# EAGLE design Linkable_LED_Matrix_Thru_Full_Mount (EAGLE 6.5.0)
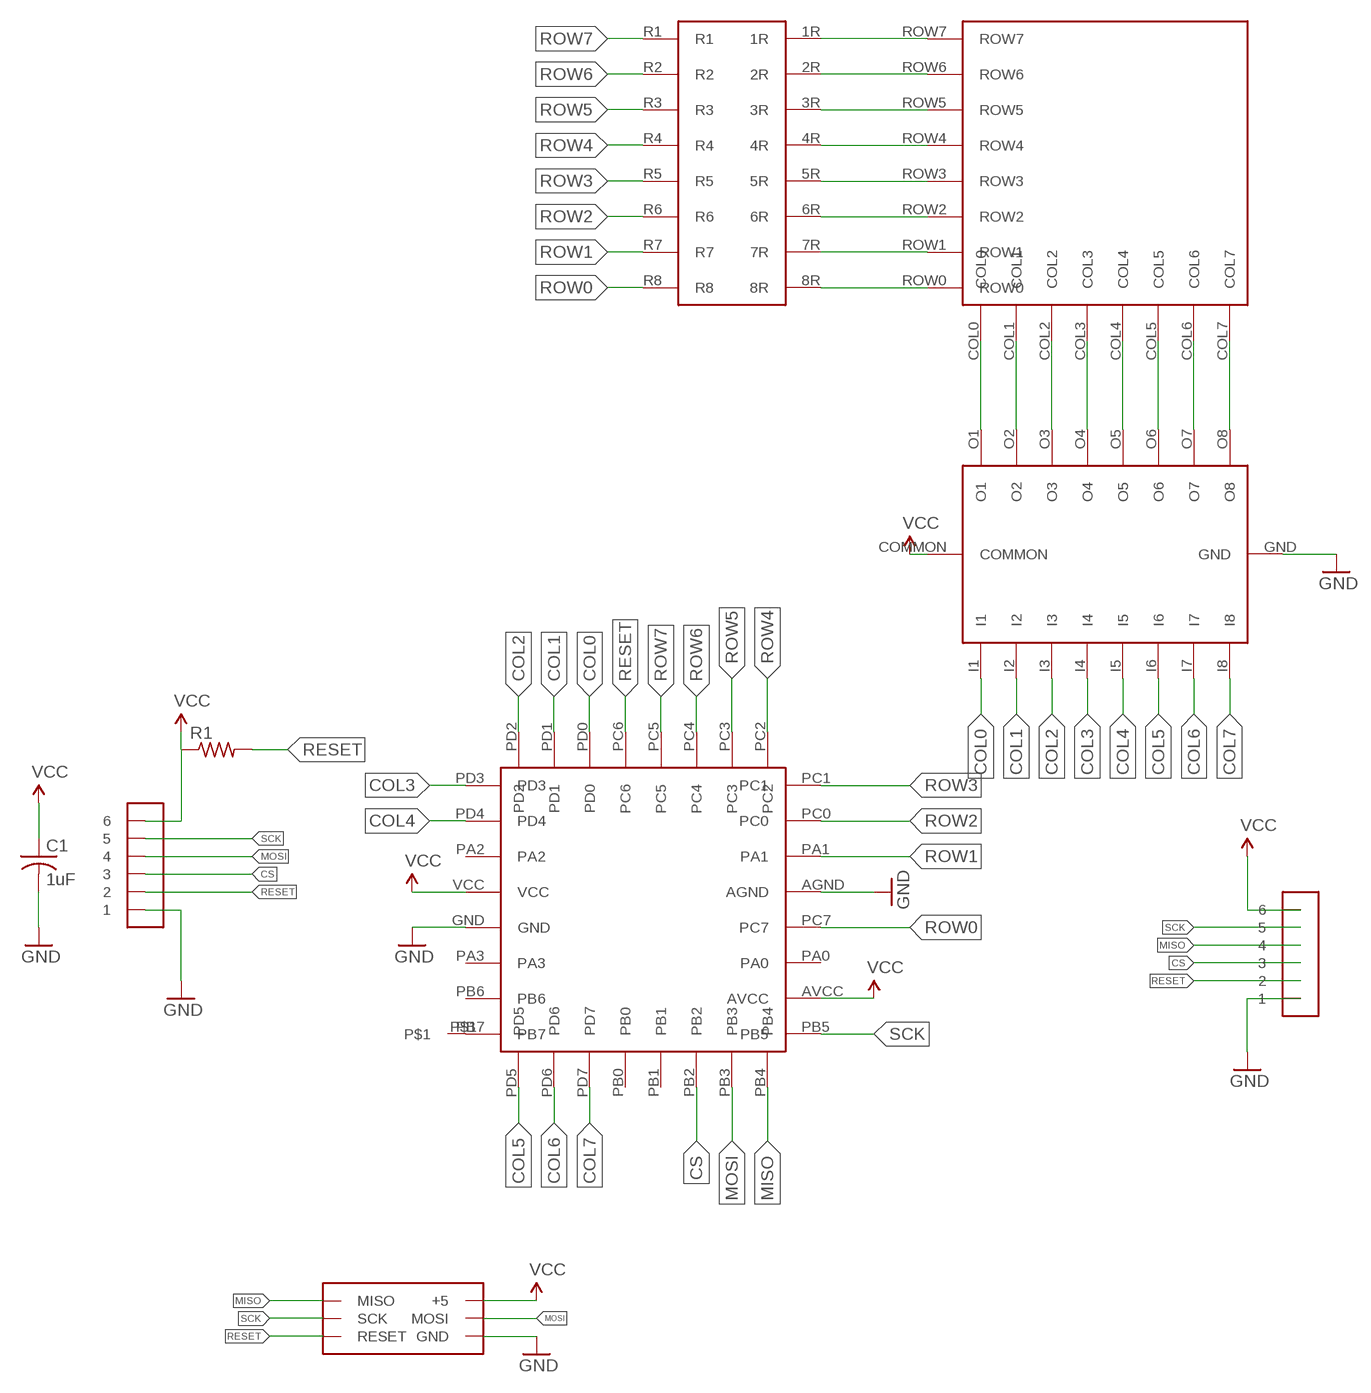
[diagram p0: schematic, sheet 1]

## Parts
C1  1uF  C-USC0603  [C0603]
R1  R-US_R0603  [R0603]
U$1  ATTINY48  [ATTINY48]
U$2  ULN2803AFWG  [ULN2803AFWG]
U$3  8X8_LED_MATRIX  [8X8_LED_MATRIX]
U$4  RES_ARRAY  [RES_ARRAY]
U$5  1X1MM_PAD  [1X1MM_PAD]
U$6  DIP1X6MALE  [DIP1X6MALE]
U$7  DIP1X6MALE  [DIP1X6MALE]
U$9  DIP2X3MALE  [DIP2X3MALE]

## Nets
COL0: U$1.PD0 U$2.I1
COL1: U$1.PD1 U$2.I2
COL2: U$1.PD2 U$2.I3
COL3: U$1.PD3 U$2.I4
COL4: U$1.PD4 U$2.I5
COL5: U$1.PD5 U$2.I6
COL6: U$1.PD6 U$2.I7
COL7: U$1.PD7 U$2.I8
CS: U$1.PB2 U$6.3 U$7.3
GND: C1.2 U$1.AGND U$1.GND U$2.GND U$6.1 U$7.1 U$9.GND
MISO: U$1.PB4 U$7.4 U$9.MISO
MOSI: U$1.PB3 U$6.4 U$9.MOSI
N$1: U$2.O1 U$3.COL0
N$2: U$2.O2 U$3.COL1
N$3: U$2.O3 U$3.COL2
N$4: U$2.O4 U$3.COL3
N$5: U$2.O5 U$3.COL4
N$6: U$2.O6 U$3.COL5
N$7: U$2.O7 U$3.COL6
N$8: U$2.O8 U$3.COL7
N$13: U$1.PB7 U$5.P$1
N$25: U$3.ROW7 U$4.1R
N$26: U$3.ROW6 U$4.2R
N$27: U$3.ROW5 U$4.3R
N$28: U$3.ROW4 U$4.4R
N$29: U$3.ROW3 U$4.5R
N$30: U$3.ROW2 U$4.6R
N$31: U$3.ROW1 U$4.7R
N$32: U$3.ROW0 U$4.8R
RESET: R1.2 U$1.PC6 U$6.2 U$7.2 U$9.RESET
ROW0: U$1.PC7 U$4.R8
ROW1: U$1.PA1 U$4.R7
ROW2: U$1.PC0 U$4.R6
ROW3: U$1.PC1 U$4.R5
ROW4: U$1.PC2 U$4.R4
ROW5: U$1.PC3 U$4.R3
ROW6: U$1.PC4 U$4.R2
ROW7: U$1.PC5 U$4.R1
SCK: U$1.PB5 U$6.5 U$7.5 U$9.SCK
VCC: C1.1 R1.1 U$1.AVCC U$1.VCC U$2.COMMON U$6.6 U$7.6 U$9.5V(+5)
Unconnected: U$1.PA0 U$1.PA2 U$1.PA3 U$1.PB0 U$1.PB1 U$1.PB6

## Library data of the parts
C1 = resistor:C-US: CAPACITOR, American symbol
R1 = resistor:R-US_: RESISTOR, American symbol
U$1 = ScottSilver:ATTINY48
U$2 = ScottSilver:ULN2803AFWG
U$3 = ScottSilver:8X8_LED_MATRIX
U$4 = ScottSilver:RES_ARRAY
U$5 = ScottSilver:1X1MM_PAD
U$6 U$7 = ScottSilver:DIP1X6MALE
U$9 = ScottSilver:DIP2X3MALE

## Board
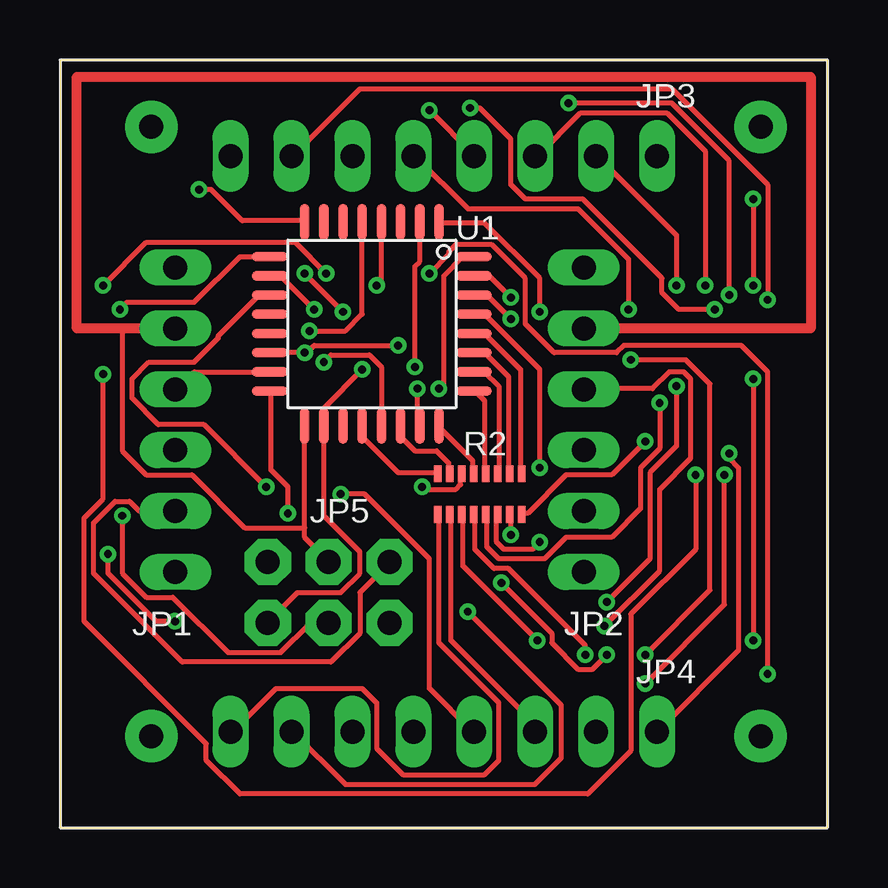
[diagram p1: board, top side]
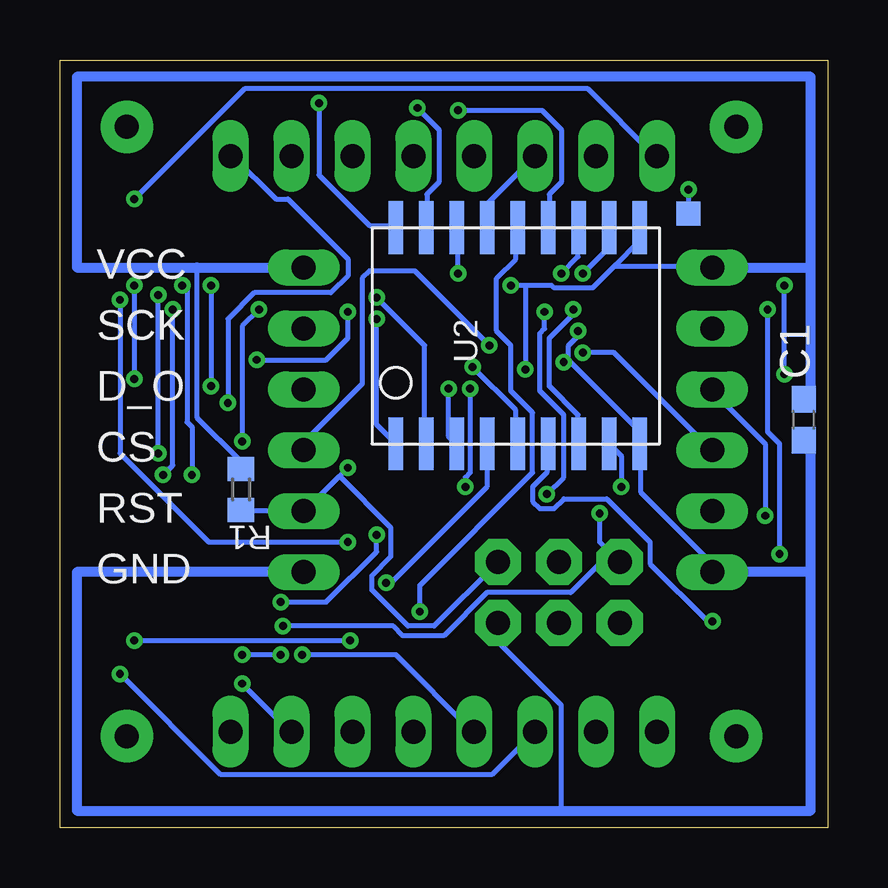
[diagram p2: board, bottom side, seen from below]

Size 32 x 32 mm. Coordinates in mm from the lower left corner, seen from the top.
Outline: 0,0 32,0 32,32 0,32 0,0
Copper layers (1*16): Top 0.0356mm / dielectric 1.5011mm / Bottom 0.0356mm
Design rules "LaenPCBOrder *": minimum track width 8mil, minimum drill 13mil, track to track 6mil, track to pad 6mil, pad to pad 6mil, via to via 6mil, smd to smd 6mil, copper to edge 15mil, drill to drill 6mil, minimum pad ring 7mil, minimum via ring 7mil, stop-mask expansion 3mil, vias tented up to drill 0mil, thermal gap 10mil
vRestrict: area 6.2,26.4 to 25.7,29.6; area 6.2,2.5 to 25.8,5.6; area 20.4,9.8 to 23.3,24.1; area 7.2,7.3 to 15.2,12.3; area 6.7,23.5 to 18.7,26.5; area 7.1,14.6 to 18.9,17.4; area 9.6,15.8 to 16.4,17.9; area 16.2,17.7 to 18.4,24.2; area 7.7,17.5 to 9.8,24.4; area 3,9 to 7,25; area 15.5,12.6 to 19.5,15.2

### Footprints (pad centres in the part's own frame; a part is rotated, then mirrored left to right if it is on the bottom)
C0603 = smd 1.1 x 1: 1 -0.85,0; 2 0.85,0
R0603 = smd 1 x 1.1: 1 -0.85,0; 2 0.85,0
ATTINY48 = smd 1.5 x 0.406: AGND 4.25,0.4; AVCC 4.25,-2; GND -4.25,-0.4; PA0 4.25,-1.2; PA1 4.25,1.2; PA2 -4.25,1.2; PA3 -4.25,-1.2; PB5 4.25,-2.8; PB6 -4.25,-2; PB7 -4.25,-2.8; PC0 4.25,2; PC1 4.25,2.8; PC7 4.25,-0.4; PD3 -4.25,2.8; PD4 -4.25,2; VCC -4.25,0.4 | smd 0.406 x 1.5: PB0 -0.4,-4.25; PB1 0.4,-4.25; PB2 1.2,-4.25; PB3 2,-4.25; PB4 2.8,-4.25; PC2 2.8,4.25; PC3 2,4.25; PC4 1.2,4.25; PC5 0.4,4.25; PC6 -0.4,4.25; PD0 -1.2,4.25; PD1 -2,4.25; PD2 -2.8,4.25; PD5 -2.8,-4.25; PD6 -2,-4.25; PD7 -1.2,-4.25
ULN2803AFWG = smd 0.6 x 2.2: COMMON 10.16,9.01; GND 10.16,0; I1 0,0; I2 1.27,0; I3 2.54,0; I4 3.81,0; I5 5.08,0; I6 6.35,0; I7 7.62,0; I8 8.89,0; O1 0,9.01; O2 1.27,9.01; O3 2.54,9.01; O4 3.81,9.01; O5 5.08,9.01; O6 6.35,9.01; O7 7.62,9.01; O8 8.89,9.01
8X8_LED_MATRIX = drill 1 long: COL0 8.89,-12; COL1 6.35,-12; COL2 -3.81,-12; COL3 -3.81,12; COL4 -6.35,-12; COL5 1.27,12; COL6 3.81,12; COL7 1.27,-12; ROW0 -8.89,-12; ROW1 3.81,-12; ROW2 -8.89,12; ROW3 -1.27,-12; ROW4 8.89,12; ROW5 -6.35,12; ROW6 6.35,12; ROW7 -1.27,12
RES_ARRAY = smd 0.7 x 0.3: 1R 1.7,3.5; 2R 1.7,3; 3R 1.7,2.5; 4R 1.7,2; 5R 1.7,1.5; 6R 1.7,1; 7R 1.7,0.5; 8R 1.7,0; R1 0,3.5; R2 0,3; R3 0,2.5; R4 0,2; R5 0,1.5; R6 0,1; R7 0,0.5; R8 0,0
1X1MM_PAD = smd 1 x 1: P$1 0,0
DIP1X6MALE = drill 1 long: 1 -6.35,0; 2 -3.81,0; 3 -1.27,0; 4 1.27,0; 5 3.81,0; 6 6.35,0
DIP2X3MALE = drill 1 pad 1.93 octagon: 5V -2.54,1.27; GND 2.54,1.27; MISO -2.54,-1.27; MOSI 0,1.27; RESET 2.54,-1.27; SCK 0,-1.27

### Placement (x,y rotation side)
C1  1,17 270 bottom
R1  24.45,14.1 270 bottom
U$1  13,21 270 top
U$2  18,16 0 bottom
U$3  16,16 0 top
U$4  15.75,14.75 270 top
U$5  5.8,25.6 0 bottom
U$6  4.81,17 90 top
U$7  21.84,17 90 top
U$9  11.2,9.8 180 bottom

### Tracks (layer width: path | path; a pad name or v marks a point on that pad's centre or on a via)
COL0  (via drill 0.33)
  Top 0.203: U$1.PD0 17.8,22.2 v18.8,21.2
  Bottom 0.203: v18.8,21.2 18.8,16.8 U$2.I1
COL1  (via drill 0.33)
  Top 0.203: U$1.PD1 17.9,23 v18.8,22.1
  Bottom 0.203: v18.8,22.1 16.8,20.1 16.8,16 U$2.I2
COL2  (via drill 0.33)
  Top 0.203: U$1.PD2 16.8,23.8 16,23 16,18.5 v15.8,18.3
  Bottom 0.203: v15.8,18.3 15.8,16.3 15.5,16 U$2.I3
COL3  (via drill 0.33)
  Top 0.203: v20,21.5 20,22.9 17.7,25.2 15.8,25.2 U$1.PD3 | v23.8,19.5 26.1,19.5 27.1,18.5 27.1,9.9 v24.4,7.2 | v22.8,7.2 22.2,6.6 21.6,6.6 20.5,7.7 20.5,8.1 v18.4,10.2
  Bottom 0.203: v20,21.5 20,20.4 20.9,19.5 v23.8,19.5 | v22.8,7.2 v24.4,7.2 | v18.4,10.2 18.2,10.2 14.2,14.2 U$2.I4
COL4  (via drill 0.33)
  Top 0.203: U$1.PD4 15,23.6 14.8,23.4 v14.8,19.2
  Bottom 0.203: v14.8,19.2 13,17.4 13,16 U$2.I5
COL5  (via drill 0.33)
  Top 0.203: U$1.PD5 7.5,23.8 5.6,21.9 2.8,21.9 v2.5,21.6 | v2,11.4 2,10.6 4,8.6 v4.8,8.6
  Bottom 0.203: v2.5,21.6 2.5,16.5 2,16 v2,11.4 | v4.8,8.6 5,8.6 7.4,11 7.4,11.9 9.2,13.7 11,13.7 11.4,13.3 12,13.3 12.3,13.6 12.3,14.2 11.7,14.8 11.7,16 U$2.I6
COL6  (via drill 0.33)
  Top 0.203: U$1.PD6 9.2,23 v10.6,21.6
  Bottom 0.203: v10.6,21.6 10.6,21.4 11.6,20.4 11.6,18.4 10.4,17.2 10.4,16 U$2.I7
COL7  (via drill 0.33)
  Top 0.203: U$1.PD7 8.3,22.2 6.6,20.5 6.6,20.4 5.6,19.4 3.7,19.4 3,18.7 3,17.9 4.1,16.8 6,16.8 v8.6,14.2
  Bottom 0.203: v8.6,14.2 8.6,15.5 U$2.I8
CS  (via drill 0.33)
  Top 0.203: U$1.PB2 v10.2,19.8 10.3,19.8 10.6,20.1 v14.1,20.1
  Bottom 0.203: v10.2,19.8 8.9,19.8 4.9,15.8 U$6.3 | v14.1,20.1 17.2,23.2 19.1,23.2 19.4,22.9 19.4,18.5 21.8,16.1 21.8,15.8 U$7.3
GND  (via drill 0.33)
  Top 0.203: U$1.GND 12.6,21.4 11.9,20.7 v10.4,20.7 | U$1.AGND 13.4,19.2 12.9,19.7 11.3,19.7 v11,19.4
  Bottom 0.203: 11.1,0.7 11.1,5.1 13.7,7.7 13.7,8.5 U$9.GND | v10.4,20.7 10.4,20.5 10.8,20.1 10.8,19.5 | 10.8,19.5 7.9,16.6 7.9,16 U$2.GND 7.8,15.9 7.8,14 4.9,11.1 4.9,10.8 U$6.1 | v11,19.4 10.9,19.5 10.8,19.5
  Bottom 0.406: U$7.1 31.3,10.65 31.3,0.7 11.1,0.7 0.7,0.7 0.7,10.65 | 0.7,10.65 U$6.1 | 0.7,10.65 0.7,16.15 C1.2
MISO  (via drill 0.33)
  Top 0.203: v9.5,13.1 9.5,14.2 8.8,14.9 8.8,18.2 U$1.PB4 | v22.7,8.4 25,10.7 25,14.1 26.3,15.4 26.3,18.7 26,19 25.4,19 24.7,18.3 21.9,18.3 U$7.4
  Bottom 0.203: v9.5,13.1 9.5,11.9 8.7,11.1 U$9.MISO 9.1,11.4 10.7,9.8 14.2,9.8 16,8 17.7,8 18.1,8.4 v22.7,8.4
MOSI  (via drill 0.33)
  Top 0.203: U$1.PB3 5.6,19 4.9,18.3 U$6.4 | v2.6,13 2.6,10.6 3.6,9.6 4.7,9.6 7,7.3 9.2,7.3 10.4,8.5 11.2,8.5 U$9.MOSI
  Bottom 0.203: v2.6,13 2.6,16 4.8,18.2 U$6.4
N$1  (via drill 0.33)
  Top 0.203: v21.2,30.2 25.5,30.2 27.9,27.8 v27.9,22.2 | v27.9,15.6 27.9,15.4 28.3,15 28.3,7.4 U$3.COL0
  Bottom 0.203: v21.2,30.2 21.2,27.2 19.1,25.1 18,25.1 U$2.O1 | v27.9,15.6 v27.9,22.2
N$2  (via drill 0.33)
  Top 0.203: v17.1,30 17.5,30 18.8,28.7 18.8,26.8 19.4,26.2 21.8,26.2 25.1,22.9 25.1,22.3 25.8,21.6 v27.3,21.6 | v27.7,14.7 27.7,9.3 v24.4,6
  Bottom 0.203: v17.1,30 16.2,29.1 16.2,26.9 16.7,26.4 16.7,25.1 U$2.O2 | v27.3,21.6 27.3,15.1 v27.7,14.7 | v24.4,6 22.4,4 U$3.COL1
N$3  (via drill 0.33)
  Top 0.203: v15.4,23.1 16.2,23.9 16.2,24 16.5,24.3 18,24.3 19.4,22.9 19.4,21 20.6,19.8 23.2,19.8 23.5,20.1 28.4,20.1 29.5,19 v29.5,6.4
  Bottom 0.203: v15.4,23.1 15.4,25 U$2.O3 | v29.5,6.4 25.3,2.2 14,2.2 U$3.COL2
N$4
  Bottom 0.203: U$2.O4 14.1,25.1 14.1,26.1 U$3.COL3
N$5  (via drill 0.33)
  Top 0.203: v17,9 20.9,5.1 20.9,2.9 19.8,1.8 11.9,1.8 9.7,4 U$3.COL4
  Bottom 0.203: v17,9 17,10.1 12.3,14.8 12.3,17.3 13.2,18.2 13.2,20.1 13.8,20.7 13.8,22.9 13,23.7 13,25 U$2.O5
N$6  (via drill 0.33)
  Top 0.203: v15.4,29.9 17.3,28 U$3.COL5
  Bottom 0.203: v15.4,29.9 11.9,29.9 11.1,29.1 11.1,26.9 11.6,26.4 11.6,25.1 U$2.O6
N$7  (via drill 0.33)
  Top 0.203: v11.1,23.1 9.8,24.4 3.6,24.4 v1.8,22.6 | v1.8,18.9 1.8,13.7 1,12.9 1,8.6 6.1,3.5 6.1,2.8 7.5,1.4 22,1.4 23.8,3.2 23.8,8.9 26.5,11.6 v26.5,14.7 | v26.9,22.6 26.9,28.2 25.3,29.8 21.7,29.8 19.9,28 U$3.COL6
  Bottom 0.203: v11.1,23.1 10.4,23.8 10.4,25 U$2.O7 | v1.8,18.9 v1.8,22.6 | v26.5,14.7 26.5,16.7 26.7,16.9 26.7,22.4 v26.9,22.6
N$8  (via drill 0.33)
  Top 0.203: v11.8,21.5 v10.2,23.1 | v11.7,13.9 12.7,13.9 15.4,11.2 15.4,5.8 17.2,4 U$3.COL7
  Bottom 0.203: v10.2,23.1 9.2,24.1 9.2,25 U$2.O8 | v11.8,21.5 11.8,20.8 12,20.6 12,18.2 11,17.2 11,14.6 v11.7,13.9
N$9  (via drill 1 pad 2.18)
  other vias: 3.81,29.21
N$10  (via drill 1 pad 2.18)
  other vias: 3.81,3.81
N$11  (via drill 1 pad 2.18)
  other vias: 29.21,29.21
N$12  (via drill 1 pad 2.18)
  other vias: 29.21,3.81
N$13  (via drill 0.33)
  Top 0.203: v5.8,26.6 6.3,26.6 7.6,25.3 10.2,25.3 U$1.PB7
  Bottom 0.203: v5.8,26.6 U$5.P$1
N$25  (via drill 0.33)
  Top 0.203: v24.4,16.1 23,14.7 21.1,14.7 19.5,13.1 19.3,13.1 U$4.1R | v23.7,21.6 23.7,23.7 21.6,25.8 17,25.8 14.8,28 U$3.ROW7
  Bottom 0.203: v24.4,16.1 24.4,20.9 v23.7,21.6
N$26  (via drill 0.33)
  Top 0.203: v18.8,12.2 18.8,13 U$4.2R | v22.8,9.4 24.6,11.2 24.6,14.8 25.7,15.9 v25.7,18.4 | v25.7,22.6 25.7,24.7 22.4,28 U$3.ROW6
  Bottom 0.203: v18.8,12.2 18.8,11.5 20.9,9.4 v22.8,9.4 | v25.7,22.6 v25.7,18.4
N$27  (via drill 0.33)
  Top 0.203: v20,11.9 19.7,11.6 18.5,11.6 18.2,11.9 18.2,13 U$4.3R | v29.5,22 29.5,26.8 25.5,30.8 12.5,30.8 9.7,28 U$3.ROW5
  Bottom 0.203: v20,11.9 25.8,11.9 29.5,15.6 v29.5,22
N$28  (via drill 0.33)
  Top 0.203: v25,17.7 25,15.8 24.2,15 24.2,13.3 23,12.1 21.1,12.1 20.2,11.2 18.3,11.2 17.8,11.7 17.8,13 U$4.4R
  Bottom 0.203: v25,17.7 25,21.2 23.9,22.3 20.7,22.3 20,23 20,23.7 22.5,26.2 23,26.2 24.8,28 U$3.ROW4
N$29  (via drill 0.33)
  Top 0.203: v21.9,7.2 21.9,7.6 18.7,10.8 18.1,10.8 17.3,11.6 17.3,13 U$4.5R
  Bottom 0.203: v21.9,7.2 18,7.2 14.8,4 U$3.ROW3
N$30  (via drill 0.33)
  Top 0.203: v19.9,7.8 16.8,10.9 16.8,13 U$4.6R | v28.9,18.7 v28.9,7.8 | v28.9,26.2 v28.9,22.6
  Bottom 0.203: v28.9,7.8 v19.9,7.8 | v28.9,22.6 v28.9,18.7 | v28.9,26.2 24.3,30.8 10,30.8 7.2,28 U$3.ROW2
N$31
  Top 0.203: U$4.7R 16.3,13 16.3,7.8 19.8,4.3 U$3.ROW1
N$32
  Top 0.203: U$4.8R 15.8,13 15.8,7.7 18.3,5.2 18.3,2.8 17.7,2.2 14.3,2.2 13.2,3.3 13.2,5.2 12.6,5.8 9,5.8 7.2,4 U$3.ROW0
RESET  (via drill 0.33)
  Top 0.203: U$1.PC6 17.7,21.4 20,19.1 v20,15 | U$6.2 3.3,13.2 2.9,13.6 2.3,13.6 1.4,12.7 1.4,10.6 5.1,6.9 11.3,6.9 12.5,8.1 12.5,9.8 13.7,11 U$9.RESET
  Bottom 0.203: R1.2 24.4,13.2 21.9,13.2 U$7.2 21.8,13.2 20.35,14.65 | 20.35,14.65 v20,15 | 20.35,14.65 18.2,12.5 18.2,11.3 19,10.5 19,9.9 17.5,8.4 16.4,8.4 13.8,11 U$9.RESET
ROW0
  Top 0.203: U$1.PC7 12.6,16.3 14.1,14.8 15.7,14.8 U$4.R8
ROW1
  Top 0.203: U$1.PA1 14.2,16.3 14.8,15.7 15.7,15.7 16.2,15.2 16.2,14.8 U$4.R7
ROW2  (via drill 0.33)
  Top 0.203: v15.1,14.2 15.2,14.1 16.5,14.1 16.7,14.3 16.7,14.7 U$4.R6 | v14.9,18.3 14.9,16.9 15,16.8 U$1.PC0
  Bottom 0.203: v15.1,14.2 15.1,14.6 14.9,14.8 v14.9,18.3
ROW3
  Top 0.203: U$4.R5 17.2,14.8 17.2,15.3 15.8,16.7 U$1.PC1
ROW4
  Top 0.203: U$4.R4 17.7,14.8 17.7,17.8 17.3,18.2 U$1.PC2
ROW5
  Top 0.203: U$1.PC3 17.7,19 18.3,18.4 18.3,14.8 U$4.R3
ROW6
  Top 0.203: U$1.PC4 17.7,19.8 18.7,18.8 18.7,14.8 U$4.R2
ROW7
  Top 0.203: U$1.PC5 17.7,20.6 19.2,19.1 19.2,14.8 U$4.R1
SCK
  Top 0.203: 10.2,12.5 10.2,12.1 11.2,11.1 U$9.SCK | 10.2,12.5 U$1.PB5 | 10.2,12.5 7.7,12.5 5.5,14.7 3.6,14.7 2.6,15.7 2.6,20.81
  Top 0.406: U$6.5 2.6,20.81 0.7,20.81 0.7,31.3 31.3,31.3 31.3,20.81 U$7.5
VCC  (via drill 0.33)
  Top 0.203: U$9.5V 8.7,8.6 9.9,9.8 11.7,9.8 12.5,10.6 12.5,11.5 11,13 U$1.AVCC 11,17.5 v12.6,19.1 | U$1.VCC 13.4,22.8 v13.2,22.6
  Bottom 0.203: 26.3,23.35 26.3,17.1 24.5,15.3 24.5,15 R1.1 | 12.6,22.6 11.5,22.6 11.4,22.5 9.8,22.5 8.85,23.45 | 12.6,22.6 v13.2,22.6 | 8.85,23.45 7.9,24.4 7.9,25 U$2.COMMON | U$6.6 5,23.4 8.8,23.4 8.85,23.45 | 12.6,22.6 v12.6,19.1
  Bottom 0.406: U$6.6 0.7,23.35 | 0.7,23.35 0.7,31.3 31.3,31.3 31.3,23.35 26.3,23.35 U$7.6 | C1.1 0.7,18.15 0.7,23.35

### Text on the board
tPlace: JP3 | U1 | R2 | JP5 | JP1 | JP2 | JP4
bPlace: VCC | U2 | SCK | D_O | CS | R1 | RST | GND